# Altium schematic sheet So_do_nguyen_ly.SchDoc
size A; SheetNumber: 1; SheetTotal: 1
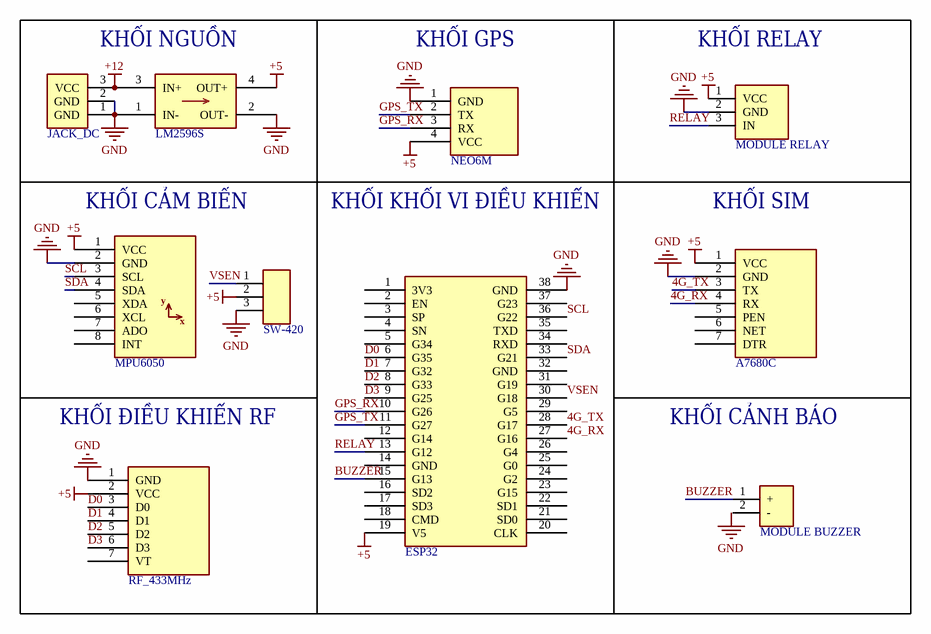
[diagram p0: So_do_nguyen_ly.SchDoc]

## Parts
B  MODULE BUZZER  [BUZZER_12mm]
ESP32  ESP32  [ESP32_38]
J1  JACK_DC  [JACK_P4]
MODULE_SIM  A7680C  [SIM800L_V2]
R  MODULE RELAY  [MICRO_START]
RF1  RF_433MHz  [SIM800L_V2]
U1  LM2596S  [MINI360]
U2  NEO6M  [NEO6M]
U3  MPU6050  [MPU6050]
Virbration_sensor1  SW-420  [2EDGVC-5.08-3P]

## Blocks framed on the sheet
KHỐI NGUỒN: J1 U1

## Nets
+5: ESP32.19(V5) MODULE_SIM.1(VCC) R.1(VCC) RF1.2(VCC) U1.4(OUT+) U2.4(VCC) U3.1(VCC) Virbration_sensor1.2
+12: J1.3(VCC) U1.3(IN+)
GND: ESP32.38(GND) J1.1(GND) J1.2(GND) MODULE_SIM.2(GND) R.2(GND) RF1.1(GND) U1.1(IN-) U1.2(OUT-) U2.1(GND) U3.2(GND) Virbration_sensor1.3
4G_RX: ESP32.27(G16) MODULE_SIM.4(RX)
4G_TX: ESP32.28(G17) MODULE_SIM.3(TX)
BUZZER: B.1(+) ESP32.15(G13)
D0: ESP32.6(G35) RF1.3(D0)
D1: ESP32.7(G32) RF1.4(D1)
D2: ESP32.8(G33) RF1.5(D2)
D3: ESP32.9(G25) RF1.6(D3)
GPS_RX: ESP32.10(G26) U2.3(RX)
GPS_TX: ESP32.11(G27) U2.2(TX)
RELAY: ESP32.13(G12) R.3(IN)
SCL: ESP32.36(G22) U3.3(SCL)
SDA: ESP32.33(G21) U3.4(SDA)
VSEN: ESP32.30(G18) Virbration_sensor1.1

Not connected (* = marked no-connect by the designer): B 2(-); ESP32 1(3V3) 2(EN) 3(SP) 4(SN) 5(G34) 12(G14) 14(GND) 16(SD2) 17(SD3) 18(CMD) 20(CLK) 21(SD0) 22(SD1) 23(G15) 24(G2) 25(G0) 26(G4) 29(G5) 31(G19) 32(GND) 34(RXD) 35(TXD) 37(G23); MODULE_SIM 5(PEN) 6(NET) 7(DTR); RF1 7(VT); U3 5(XDA) 6(XCL) 7(ADO) 8(INT)

## Notes on the sheet
- (near U2) KHỐI GPS
- (near R) KHỐI RELAY
- (near U3) KHỐI CẢM BIẾN
- KHỐI KHỐI VI ĐIỀU KHIỂN
- KHỐI SIM
- KHỐI ĐIỀU KHIỂN RF
- KHỐI CẢNH BÁO
- Labels drawn without touching a wire or pin: GND
- (in symbol MPU6050) y; x

## Library data of the parts
B = BUZZER_12mm: BUZZER MAGNETIC 12MM; Digikey PN: 433-WT-1209T-ND; Mouser PN: 433-WT-1209T-ND; JLCPCB PN: C781866
ESP32 = ESP32_38: Microcontoller Board 38 Pins Wifi 2.4GHz BLE 4.2 ESP32-WROOM-32D; ComponentLink1Description: Datasheet; ComponentLink1URL: https://www.mouser.com/datasheet/2/891/esp32_wroom_32d_esp32_wroom_32u_datasheet_en-1365844.pdf
J1 = JACK_P4: 9V Battery Connector Jack P4.
MODULE_SIM RF1 = SIM800L_V2
R = MICRO_START: Module Start for Robbot Sumo.
U1 = MINI360: MODULE BUCK STEP DOWN 3A 18x12mm; ComponentLink1Description: Datasheet; ComponentLink1URL: https://cdn-shop.adafruit.com/datasheets/MP2307_r1.9.pdf
U3 = MPU6050: IMU ACCEL/GYRO 3-AXIS I2C; ComponentLink1Description: Datasheet; ComponentLink1URL: https://invensense.tdk.com/wp-content/uploads/2015/02/MPU-6000-Datasheet1.pdf
Virbration_sensor1 = 2EDGVC-5.08-3P: Female Connector KF2EDGVC-3P, pitch 5.08mm.; JLCPCB PN: C441387